# EAGLE design module (EAGLE 7.7.0)
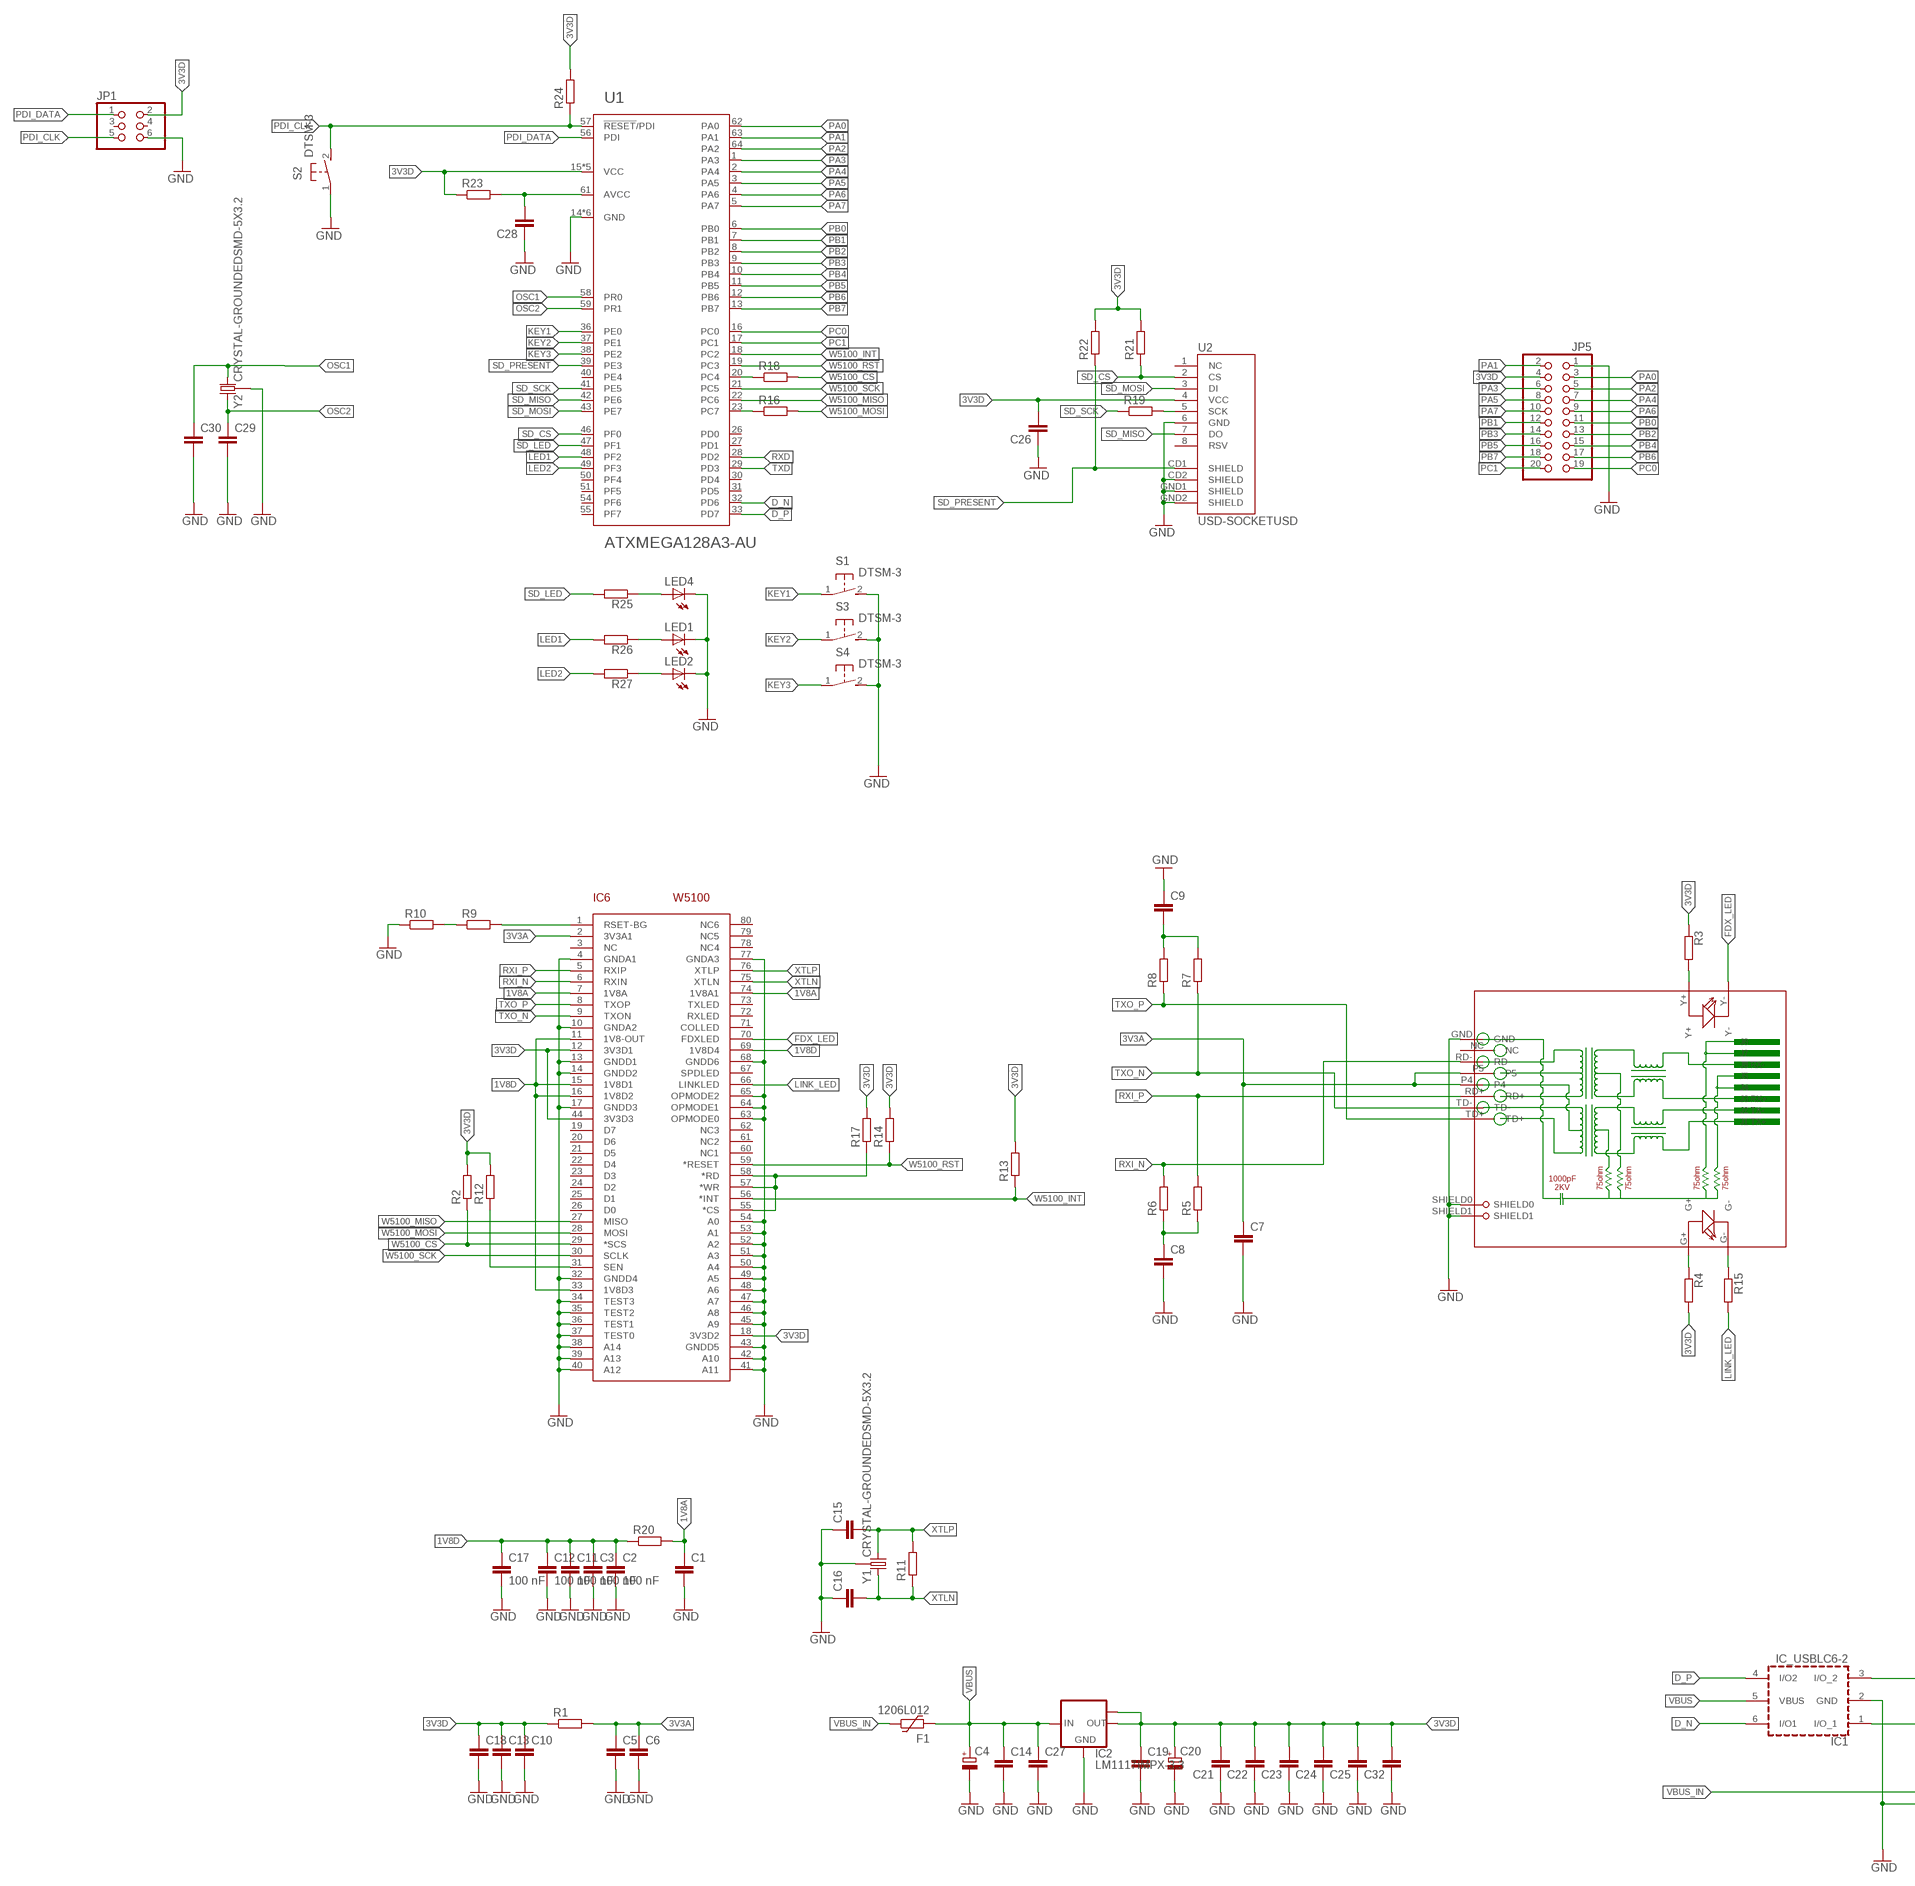
[diagram p0: schematic, sheet 1, part 1 of 2]
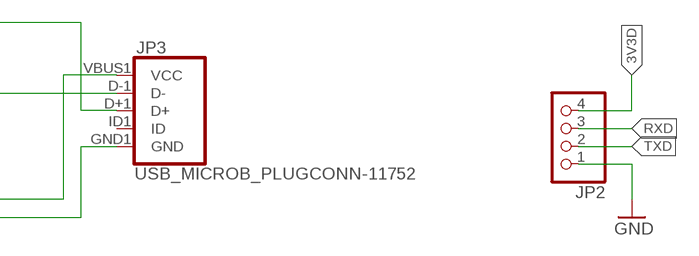
[diagram p1: schematic, sheet 1, part 2 of 2]

## Parts
C1  C-EUC0603  [C0603]
C2  100 nF  C-EUC0402  [C0402]
C3  100 nF  C-EUC0603  [C0603]
C4  CPOL-EUSMCB  [SMC_B]
C5  C-EUC0603  [C0603]
C6  C-EUC0603  [C0603]
C7  C-EUC0603  [C0603]
C8  C-EUC0603  [C0603]
C9  C-EUC0603  [C0603]
C10  C-EUC0402  [C0402]
C11  100 nF  C-EUC0402  [C0402]
C12  100 nF  C-EUC0402  [C0402]
C13  C-EUC0402  [C0402]
C14  C-EUC0603  [C0603]
C15  C-EUC0603  [C0603]
C16  C-EUC0603  [C0603]
C17  100 nF  C-EUC0402  [C0402]
C18  C-EUC0402  [C0402]
C19  C-EUC0603  [C0603]
C20  CPOL-EUSMCB  [SMC_B]
C21  C-EUC0402  [C0402]
C22  C-EUC0402  [C0402]
C23  C-EUC0402  [C0402]
C24  C-EUC0402  [C0402]
C25  C-EUC0402  [C0402]
C26  C-EUC0603  [C0603]
C27  C-EUC0603  [C0603]
C28  C-EUC0402  [C0402]
C29  C-EUC0603  [C0603]
C30  C-EUC0603  [C0603]
C32  C-EUC0603  [C0603]
F1  1206L012  [1206L]
IC1  IC_USBLC6-2  [SOT-23-6L]
IC2  LM1117IMPX-3.3  [SOT223]
IC6  W5100  [SQFP-S-10X10-80]
JP1  PINHD-2X3  [2X03]
JP2  PINHD-1X4  [1X04]
JP3  USB_MICROB_PLUGCONN-11752  [USB-B-MICRO-SMD_V03]
JP5  PINHD-2X10_2.54-SMD  [2X10SMD]
LED1  LEDCHIPLED_0805  [CHIPLED_0805]
LED2  LEDCHIPLED_0805  [CHIPLED_0805]
LED4  LEDCHIPLED_0805  [CHIPLED_0805]
R1  R-EU_R0805  [R0805]
R2  R-EU_R0603  [R0603]
R3  R-EU_R0603  [R0603]
R4  R-EU_R0603  [R0603]
R5  R-EU_R0603  [R0603]
R6  R-EU_R0603  [R0603]
R7  R-EU_R0603  [R0603]
R8  R-EU_R0603  [R0603]
R9  R-EU_R0603  [R0603]
R10  R-EU_R0603  [R0603]
R11  R-EU_R0603  [R0603]
R12  R-EU_R0402  [R0402]
R13  R-EU_R0603  [R0603]
R14  R-EU_R0402  [R0402]
R15  R-EU_R0603  [R0603]
R16  R-EU_R0603  [R0603]
R17  R-EU_R0603  [R0603]
R18  R-EU_R0603  [R0603]
R19  R-EU_R0603  [R0603]
R20  R-EU_R0805  [R0805]
R21  R-EU_R0603  [R0603]
R22  R-EU_R0603  [R0603]
R23  R-EU_R0805  [R0805]
R24  R-EU_R0603  [R0603]
R25  R-EU_R0603  [R0603]
R26  R-EU_R0603  [R0603]
R27  R-EU_R0603  [R0603]
RJ1  HR911105A  [HR911105A]
S1  DTSM-3  [DTSM-3]
S2  DTSM-3  [DTSM-3]
S3  DTSM-3  [DTSM-3]
S4  DTSM-3  [DTSM-3]
U1  ATXMEGA128A3-AU  [TQFP-64A-64]
U2  USD-SOCKETUSD  [USD-SOCKET-PP]
Y1  CRYSTAL-GROUNDEDSMD-5X3.2  [CRYSTAL-SMD-5X3.2-4PAD]
Y2  CRYSTAL-GROUNDEDSMD-5X3.2  [CRYSTAL-SMD-5X3.2-4PAD]

## Nets
1V8A: C1.1 IC6.7(1V8A) IC6.74(1V8A1) R20.2
1V8D: C2.1 C3.1 C11.1 C12.1 C17.1 IC6.11(1V8-OUT) IC6.15(1V8D1) IC6.16(1V8D2) IC6.33(1V8D3) IC6.69(1V8D4) R20.1
3V3A: C5.1 C6.1 C7.1 IC6.2(3V3A1) R1.2 RJ1.P4 RJ1.P5
3V3D: C10.1 C13.1 C18.1 C19.1 C20.+ C21.2 C22.2 C23.2 C24.2 C25.2 C26.2 C32.2 IC2.2(OUT) IC2.TAB(OUT1) IC6.12(3V3D1) IC6.18(3V3D2) IC6.44(3V3D3) JP1.2 JP2.4 JP5.4 R1.1 R2.2 R3.1 R4.2 R12.2 R13.2 R14.2 R17.2 R21.2 R22.2 R23.1 R24.2 U1.15(VCC) U1.25(VCC) U1.35(VCC) U1.45(VCC) U1.53(VCC) U2.4(VCC)
_W5100_CS: R18.1 U1.20(PC4)
AVCC: C28.2 R23.2 U1.61(AVCC)
D_N: IC1.6(I/O1) U1.32(PD6)
D_P: IC1.4(I/O2) U1.33(PD7)
DN: IC1.3(I/O_2) JP3.D+1(D+)
DP: IC1.1(I/O_1) JP3.D-1(D-)
FDX_LED: IC6.70(FDXLED) RJ1.Y-
GND: C1.2 C2.2 C3.2 C4.- C5.2 C6.2 C7.2 C8.2 C9.1 C10.2 C11.2 C12.2 C13.2 C14.2 C15.1 C16.1 C17.2 C18.2 C19.2 C20.- C21.1 C22.1 C23.1 C24.1 C25.1 C26.1 C27.2 C28.1 C29.2 C30.2 C32.1 IC1.2(GND) IC2.1(GND) IC6.4(GNDA1) IC6.10(GNDA2) IC6.13(GNDD1) IC6.14(GNDD2) IC6.17(GNDD3) IC6.32(GNDD4) IC6.34(TEST3) IC6.35(TEST2) IC6.36(TEST1) IC6.37(TEST0) IC6.38(A14) IC6.39(A13) IC6.40(A12) IC6.41(A11) IC6.42(A10) IC6.43(GNDD5) IC6.45(A9) IC6.46(A8) IC6.47(A7) IC6.48(A6) IC6.49(A5) IC6.50(A4) IC6.51(A3) IC6.52(A2) IC6.53(A1) IC6.54(A0) IC6.63(OPMODE0) IC6.64(OPMODE1) IC6.65(OPMODE2) IC6.68(GNDD6) IC6.77(GNDA3) JP1.6 JP2.1 JP3.GND1(GND) JP5.1 LED1.C LED2.C LED4.C R10.1 RJ1.GND RJ1.SHIELD0 RJ1.SHIELD1 S1.2 S2.1 S3.2 S4.2 U1.14(GND) U1.24(GND) U1.34(GND) U1.44(GND) U1.52(GND) U1.60(GND) U2.6(GND) U2.CD2(SHIELD) U2.GND1(SHIELD) U2.GND2(SHIELD) Y1.2 Y1.4 Y2.2 Y2.4
KEY1: S1.1 U1.36(PE0)
KEY2: S3.1 U1.37(PE1)
KEY3: S4.1 U1.38(PE2)
LED1: R26.2 U1.48(PF2)
LED2: R27.2 U1.49(PF3)
LINK_LED: IC6.66(LINKLED) R15.2
N$1: R4.1 RJ1.G+
N$2: R3.2 RJ1.Y+
N$3: C9.2 R7.2 R8.2
N$4: C8.1 R5.1 R6.1
N$5: R15.1 RJ1.G-
N$6: IC6.1(RSET-BG) R9.2
N$7: R9.1 R10.2
N$10: IC6.31(SEN) R12.1
N$11: R16.1 U1.23(PC7)
N$13: R19.2 U2.5(SCK)
N$14: LED4.A R25.1
N$15: LED1.A R26.1
N$16: LED2.A R27.1
N$26: IC6.55(*CS) IC6.57(*WR) IC6.58(*RD) R17.1
OSC1: C30.1 U1.58(PR0) Y2.1
OSC2: C29.1 U1.59(PR1) Y2.3
PA0: JP5.3 U1.62(PA0)
PA1: JP5.2 U1.63(PA1)
PA2: JP5.5 U1.64(PA2)
PA3: JP5.6 U1.1(PA3)
PA4: JP5.7 U1.2(PA4)
PA5: JP5.8 U1.3(PA5)
PA6: JP5.9 U1.4(PA6)
PA7: JP5.10 U1.5(PA7)
PB0: JP5.11 U1.6(PB0)
PB1: JP5.12 U1.7(PB1)
PB2: JP5.13 U1.8(PB2)
PB3: JP5.14 U1.9(PB3)
PB4: JP5.15 U1.10(PB4)
PB5: JP5.16 U1.11(PB5)
PB6: JP5.17 U1.12(PB6)
PB7: JP5.18 U1.13(PB7)
PC0: JP5.19 U1.16(PC0)
PC1: JP5.20 U1.17(PC1)
PDI_CLK: JP1.5 R24.1 S2.2 U1.57(!RESET!/PDI)
PDI_DATA: JP1.1 U1.56(PDI)
RXD: JP2.3 U1.28(PD2)
RXI_N: IC6.6(RXIN) R6.2 RJ1.RD-
RXI_P: IC6.5(RXIP) R5.2 RJ1.RD+
SD_CS: R21.1 U1.46(PF0) U2.2(CS)
SD_LED: R25.2 U1.47(PF1)
SD_MISO: U1.42(PE6) U2.7(DO)
SD_MOSI: U1.43(PE7) U2.3(DI)
SD_PRESENT: R22.1 U1.39(PE3) U2.CD1(SHIELD)
SD_SCK: R19.1 U1.41(PE5)
TXD: JP2.2 U1.29(PD3)
TXO_N: IC6.9(TXON) R7.1 RJ1.TD-
TXO_P: IC6.8(TXOP) R8.1 RJ1.TD+
VBUS: C4.+ C14.1 C27.1 F1.2 IC1.5(VBUS) IC2.3(IN)
VBUS_IN: F1.1 JP3.VBUS1(VCC)
W5100_CS: IC6.29(*SCS) R2.1 R18.2
W5100_INT: IC6.56(*INT) R13.1 U1.18(PC2)
W5100_MISO: IC6.27(MISO) U1.22(PC6)
W5100_MOSI: IC6.28(MOSI) R16.2
W5100_RST: IC6.59(*RESET) R14.1 U1.19(PC3)
W5100_SCK: IC6.30(SCLK) U1.21(PC5)
XTLN: C16.2 IC6.75(XTLN) R11.1 Y1.3
XTLP: C15.2 IC6.76(XTLP) R11.2 Y1.1
Unconnected: IC6.3(NC) IC6.19(D7) IC6.20(D6) IC6.21(D5) IC6.22(D4) IC6.23(D3) IC6.24(D2) IC6.25(D1) IC6.26(D0) IC6.60(NC1) IC6.61(NC2) IC6.62(NC3) IC6.67(SPDLED) IC6.71(COLLED) IC6.72(RXLED) IC6.73(TXLED) IC6.78(NC4) IC6.79(NC5) IC6.80(NC6) JP1.3 JP1.4 JP3.ID1(ID) RJ1.NC U1.26(PD0) U1.27(PD1) U1.30(PD4) U1.31(PD5) U1.40(PE4) U1.50(PF4) U1.51(PF5) U1.54(PF6) U1.55(PF7) U2.1(NC) U2.8(RSV)

## Library data of the parts
C1-C3 C5-C19 C21-C30 C32 = rcl:C-EU: CAPACITOR, European symbol
C4 C20 = rcl:CPOL-EU: POLARIZED CAPACITOR, European symbol
F1 = polyfuse-smd_10:?: Polyfuse Resettable PTC Source: http://www.littelfuse.com/products/resettable-ptcs.aspx; MF: Littelfuse; MPN: 1206L012; OC_FARNELL: 1596988; OC_NEWARK: 05M2298
IC1 = dp_devices:IC_USBLC6-2
IC2 = lm1117:LM1117IMPX-*
IC6 = SmartPrj:W5100
JP1 = pinhead:PINHD-2X3: PIN HEADER
JP2 = pinhead:PINHD-1X4: PIN HEADER
JP3 = SparkFun-Connectors:USB_MICROB_PLUG: USB Micro-B connectors Some male, some female. Watch your step!; PROD_ID: CONN-11752
JP5 = pinhead-2:PINHD-2X10: PIN HEADER
LED1 LED2 LED4 = led:LED: LED OSRAM: - CHIPLED LG R971, LG N971, LY N971, LG Q971, LY Q971, LO R971, LY R971 LH N974, LH R974 LS Q976, LO Q976, LY Q976 LO Q996 - Hyper CHIPLED LW Q18S LB Q993, LB Q99A, LB R99A - SideLED LS A670, LO A670, LY A670, LG A670, LP A670 LB A673, LV A673, LT A673, LW A673 LH A674 LY A675 LS A676, LA A676, LO A676, LY A676, LW A676 LS A679, LY A679, LG A679 - Hyper Micro SIDELED® LS Y876, LA Y876, LO Y876, LY Y876 LT Y87S - SmartLED LW L88C, LW L88S LB L89C, LB L89S, LG L890 LS L89K, LO L89K, LY L89K LS L896, LA L896, LO L896, LY L896 - TOPLED LS T670, LO T670, LY T670, LG T670, LP T670 LSG T670, LSP T670, LSY T670, LOP T670, LYG T670 LG T671, LOG T671, LSG T671 LB T673, LV T673, LT T673, LW T673 LH T674 LS T676, LA T676, LO T676, LY T676, LB T676, LH T676, LSB T676, LW T676 LB T67C, LV T67C, LT T67C, LS T67K, LO T67K, LY T67K, LW E67C LS E67B, LA E67B, LO E67B, LY E67B, LB E67C, LV E67C, LT E67C LW T67C LS T679, LY T679, LG T679 LS T770, LO T770, LY T770, LG T770, LP T770 LB T773, LV T773, LT T773, LW T773 LH T774 LS E675, LA E675, LY E675, LS T675 LS T776, LA T776, LO T776, LY T776, LB T776 LHGB T686 LT T68C, LB T68C - Hyper Mini TOPLED® LB M676 - Mini TOPLED Santana® LG M470 LS M47K, LO M47K, LY M47K Source: http://www.osram.convergy.de LUXEON: - LUMILED® LXK2-PW12-R00, LXK2-PW12-S00, LXK2-PW14-U00, LXK2-PW14-V00 LXK2-PM12-R00, LXK2-PM12-S00, LXK2-PM14-U00 LXK2-PE12-Q00, LXK2-PE12-R00, LXK2-PE12-S00, LXK2-PE14-T00, LXK2-PE14-U00 LXK2-PB12-K00, LXK2-PB12-L00, LXK2-PB12-M00, LXK2-PB14-N00, LXK2-PB14-P00, LXK2-PB14-Q00 LXK2-PR12-L00, LXK2-PR12-M00, LXK2-PR14-Q00, LXK2-PR14-R00 LXK2-PD12-Q00, LXK2-PD12-R00, LXK2-PD12-S00 LXK2-PH12-R00, LXK2-PH12-S00 LXK2-PL12-P00, LXK2-PL12-Q00, LXK2-PL12-R00 Source: www.luxeon.com KINGBRIGHT: KA-3528ASYC Source: www.kingbright.com
R1-R27 = rcl:R-EU_: RESISTOR, European symbol
RJ1 = hanrun:HR911105A
S1-S4 = switch-tact:DTSM-3
U1 = atmel-xmega:ATXMEGA128A3: 8/16-bit XMEGA A3 Microcontroller Features High-performance, Low-power 8/16-bit Atmel® AVR® XMEGATM Microcontroller Non-volatile Program and Data Memories – 64 KB - 256 KB of In-System Self-Programmable Flash – 4 KB - 8 KB Boot Code Section with Independent Lock Bits – 2 KB - 4 KB EEPROM – 4 KB - 16 KB Internal SRAM Peripheral Features – Four-channel DMA Controller with support for external requests – Eight-channel Event System – Seven 16-bit Timer/Counters Four Timer/Counters with 4 Output Compare or Input Capture channels Three Timer/Counters with 2 Output Compare or Input Capture channels High Resolution Extensions on all Timer/Counters Advanced Waveform Extension on one Timer/Counter – Seven USARTs IrDA Extension on 1 USART – AES and DES Crypto Engine – Two Two-wire Interfaces with dual address match (I2C and SMBus compatible) – Three SPI (Serial Peripheral Interfaces) – 16-bit Real Time Counter with Separate Oscillator – Two Eight-channel, 12-bit, 2 Msps Analog to Digital Converters – One Two-channel, 12-bit, 1 Msps Digital to Analog Converter – Four Analog Comparators with Window compare function – External Interrupts on all General Purpose I/O pins – Programmable Watchdog Timer with Separate On-chip Ultra Low Power Oscillator Special Microcontroller Features – Power-on Reset and Programmable Brown-out Detection – Internal and External Clock Options with PLL – Programmable Multi-level Interrupt Controller – Sleep Modes: Idle, Power-down, Standby, Power-save, Extended Standby – Advanced Programming, Test and Debugging Interfaces JTAG (IEEE 1149.1 Compliant) Interface for test, debug and programming PDI (Program and Debug Interface) for programming, test and debugging I/O and Packages – 50 Programmable I/O Lines – 64-lead TQFP – 64-pad QFN Operating Voltage – 1.6 – 3.6V Speed performance – 0 – 12 MHz @ 1.6 – 3.6V – 0 – 32 MHz @ 2.7 – 3.6V
U2 = SparkFun-Connectors:USD-SOCKET: microSD Socket Push-push type uSD socket. Schematic element and footprint production proven. Spark Fun Electronics SKU : PRT-00127. tDoc lines correctly indicate media card edge positions when inserting (unlocked, locked, depressed).
Y1 Y2 = SparkFun-Clocks:CRYSTAL-GROUNDED: Crystals w/ Ground Pin (Generic) These are passive quartz crystals, which can be used as a clock source for a microcontroller. Crystal's are usually two-terminal devices. A third terminal may be optionally connected to ground, as recommended by the manufaturer.

## Board
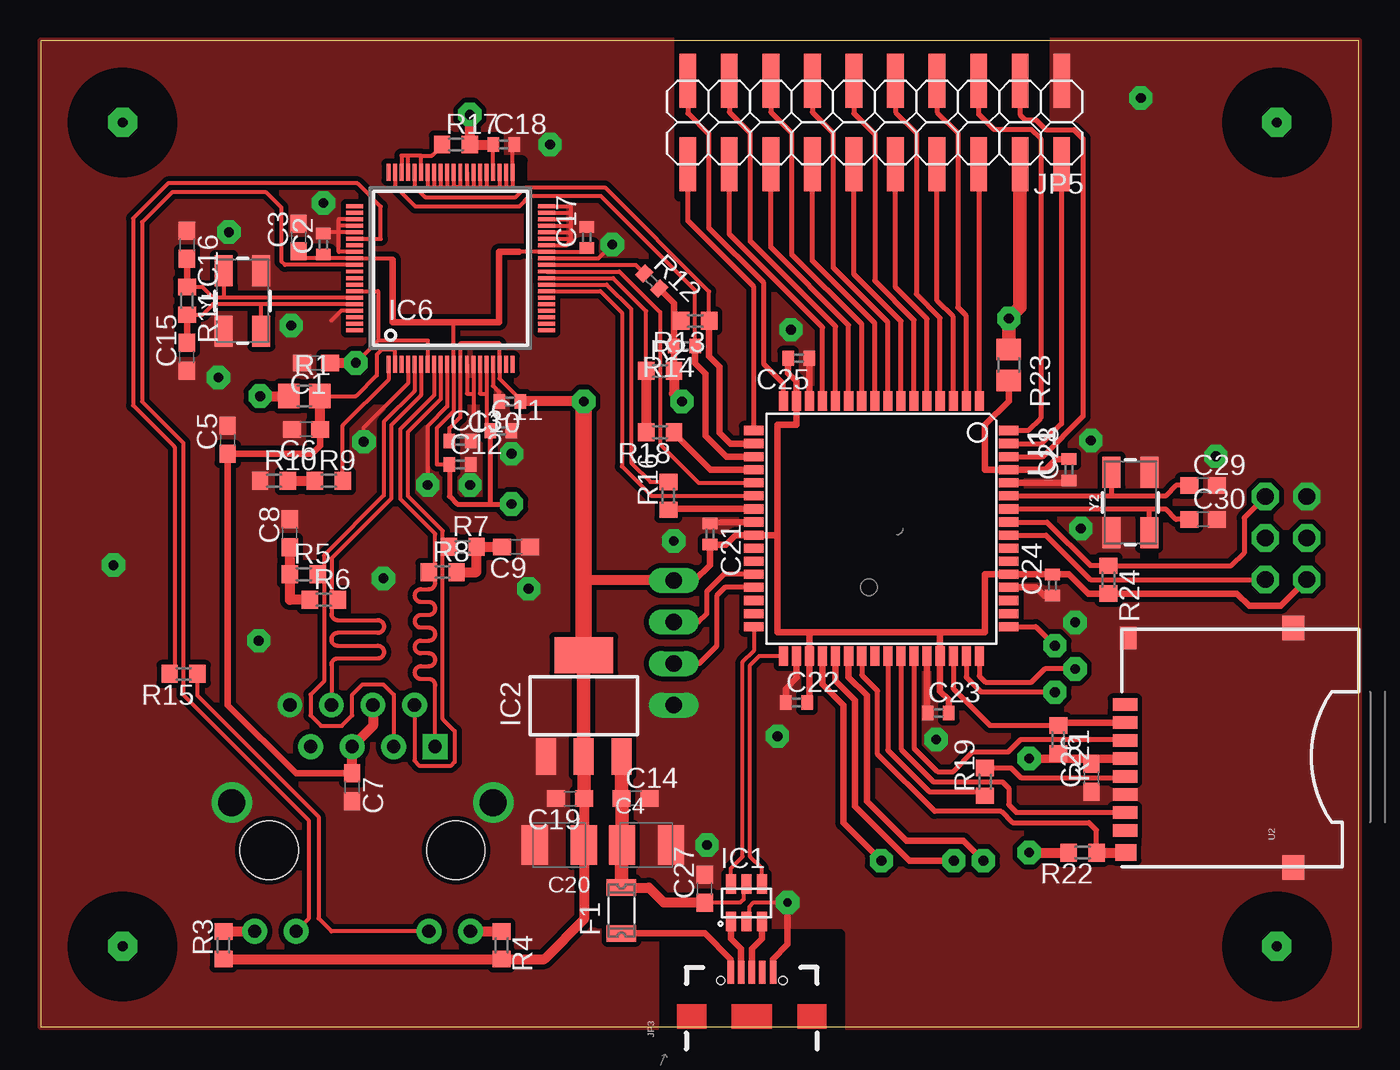
[diagram p2: board, top side]
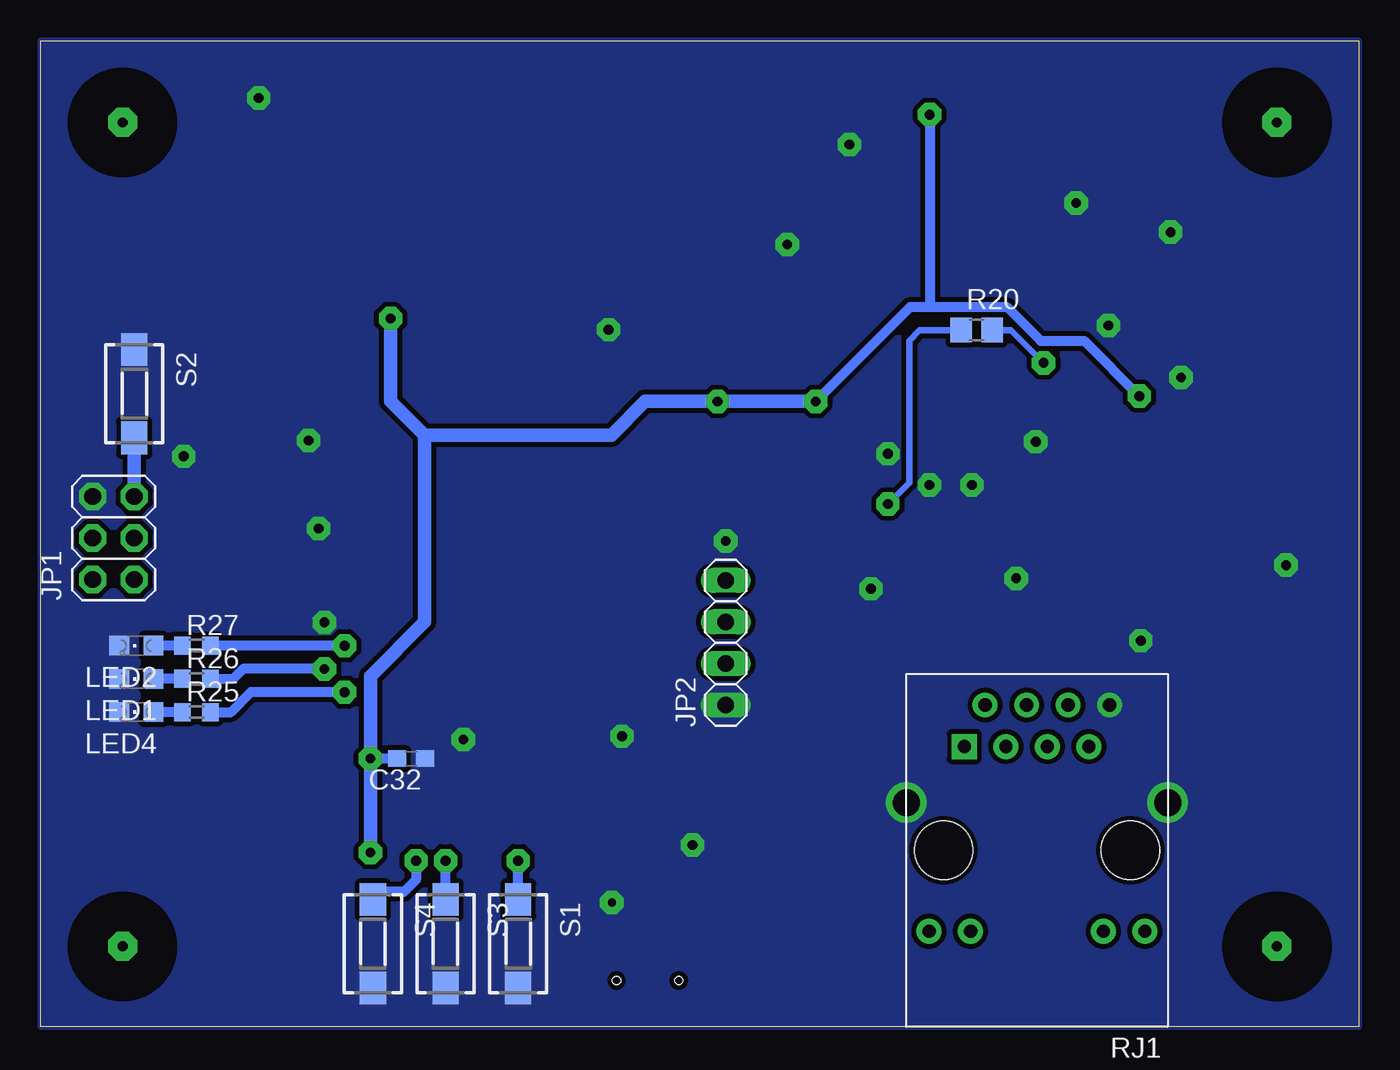
[diagram p3: board, bottom side, seen from below]

Size 80.64 x 60.31 mm. Coordinates in mm from the lower left corner, seen from the top.
Outline: 0,0 80.64,0 80.64,60.31 0,60.31 0,0
Copper layers (1*16): Top 0.035mm / dielectric 1.5mm / Bottom 0.035mm
Design rules "default *": minimum track width 10mil, minimum drill 24mil, track to track 8mil, track to pad 8mil, pad to pad 8mil, via to via 8mil, smd to smd 8mil, copper to edge 0mil, drill to drill 8mil, minimum pad ring 10mil, minimum via ring 8mil, stop-mask expansion 4mil, vias tented up to drill 0mil, thermal gap 10mil
tRestrict: area 20.3,38.4 to 27.3,39.4; area 23.5,51.4 to 29.5,53; area 29.8,47.6 to 31.9,51.4; area 34.1,6.4 to 34.7,17.7; area 34.9,6.2 to 36.4,7.9; area 41.9,5.7 to 44.5,8.1; area 38.1,0 to 48.9,5.7; area 43,24.2 to 44.2,36.8; area 45.2,22.1 to 57.7,23.3; area 58.6,24.2 to 59.8,36.8; area 45.1,37.7 to 57.7,38.9; area 2,52.3 to 8,58.4; 4 more areas
bRestrict: area 2,52.3 to 8,58.4; area 72.6,52.3 to 78.7,58.4; area 72.6,1.9 to 78.7,8; area 2,1.9 to 8,8

### Footprints (pad centres in the part's own frame; a part is rotated, then mirrored left to right if it is on the bottom)
C0603 = smd 1.1 x 1: 1 -0.85,0; 2 0.85,0
C0402 = smd 0.7 x 0.9: 1 -0.65,0; 2 0.65,0
SMC_B = smd 1.6 x 2.4: + -1.5,0; - 1.5,0
1206L = smd 1 x 1.8: 1 -1.4,0; 2 1.4,0
SOT-23-6L = smd 0.6 x 1.2: 1 -0.95,-2.3; 2 0,-2.3; 3 0.95,-2.3; 4 0.95,0; 5 0,0; 6 -0.95,0
SOT223 = smd 1.219 x 2.235: 1 -2.311,-3.099; 2 0,-3.099; 3 2.311,-3.099 | smd 3.6 x 2.2: TAB 0,3.099
SQFP-S-10X10-80 = smd 0.241 x 1.041: 1 -3.8,-5.879; 2 -3.4,-5.879; 3 -3,-5.879; 4 -2.6,-5.879; 5 -2.2,-5.879; 6 -1.8,-5.879; 7 -1.4,-5.879; 8 -1,-5.879; 9 -0.6,-5.879; 10 -0.2,-5.879; 11 0.2,-5.879; 12 0.6,-5.879; 13 1,-5.879; 14 1.4,-5.879; 15 1.8,-5.879; 16 2.2,-5.879; 17 2.6,-5.879; 18 3,-5.879; 19 3.4,-5.879; 20 3.8,-5.879; 41 3.8,5.879; 42 3.4,5.879; 43 3,5.879; 44 2.6,5.879; 45 2.2,5.879; 46 1.8,5.879; 47 1.4,5.879; 48 1,5.879; 49 0.6,5.879; 50 0.2,5.879; 51 -0.2,5.879; 52 -0.6,5.879; 53 -1,5.879; 54 -1.4,5.879; 55 -1.8,5.879; 56 -2.2,5.879; 57 -2.6,5.879; 58 -3,5.879; 59 -3.4,5.879; 60 -3.8,5.879 | smd 1.041 x 0.241: 21 5.879,-3.8; 22 5.879,-3.4; 23 5.879,-3; 24 5.879,-2.6; 25 5.879,-2.2; 26 5.879,-1.8; 27 5.879,-1.4; 28 5.879,-1; 29 5.879,-0.6; 30 5.879,-0.2; 31 5.879,0.2; 32 5.879,0.6; 33 5.879,1; 34 5.879,1.4; 35 5.879,1.8; 36 5.879,2.2; 37 5.879,2.6; 38 5.879,3; 39 5.879,3.4; 40 5.879,3.8; 61 -5.879,3.8; 62 -5.879,3.4; 63 -5.879,3; 64 -5.879,2.6; 65 -5.879,2.2; 66 -5.879,1.8; 67 -5.879,1.4; 68 -5.879,1; 69 -5.879,0.6; 70 -5.879,0.2; 71 -5.879,-0.2; 72 -5.879,-0.6; 73 -5.879,-1; 74 -5.879,-1.4; 75 -5.879,-1.8; 76 -5.879,-2.2; 77 -5.879,-2.6; 78 -5.879,-3; 79 -5.879,-3.4; 80 -5.879,-3.8
2X03 = drill 1.016 pad 1.676 octagon: 1 -2.54,-1.27; 2 -2.54,1.27; 3 0,-1.27; 4 0,1.27; 5 2.54,-1.27; 6 2.54,1.27
1X04 = drill 1.016 long: 1 -3.81,0; 2 -1.27,0; 3 1.27,0; 4 3.81,0
USB-B-MICRO-SMD_V03 = smd 1.4 x 0.4: D+1 2.7,0; D-1 2.7,0.65; GND1 2.7,-1.3; ID1 2.7,-0.65; VBUS1 2.7,1.3 | hole 0.5: 2.2,1.9; 2.2,-1.9
2X10SMD = smd 1.016 x 3.302: 1 -1.27,-3.81; 2 -1.27,1.27; 3 1.27,-3.81; 4 1.27,1.27; 5 3.81,-3.81; 6 3.81,1.27; 7 6.35,-3.81; 8 6.35,1.27; 9 8.89,-3.81; 10 8.89,1.27; 11 11.43,-3.81; 12 11.43,1.27; 13 13.97,-3.81; 14 13.97,1.27; 15 16.51,-3.81; 16 16.51,1.27; 17 19.05,-3.81; 18 19.05,1.27; 19 21.59,-3.81; 20 21.59,1.27
CHIPLED_0805 = smd 1.2 x 1.2: A 0,-1.05; C 0,1.05
R0805 = smd 1.3 x 1.5: 1 -0.95,0; 2 0.95,0
R0603 = smd 1 x 1.1: 1 -0.85,0; 2 0.85,0
R0402 = smd 0.7 x 0.9: 1 -0.65,0; 2 0.65,0
HR911105A = drill 0.813 pad 1.524: G+ 4.953,-6.604; G- 4.953,-4.064; GND -8.89,4.445; NC -6.35,3.175; P4 -8.89,-0.635; P5 -6.35,0.635; RD+ -6.35,-1.905; RD- -8.89,1.905; TD- -8.89,-3.175; Y+ 4.953,6.604; Y- 4.953,4.064 | drill 1.651 pad 2.159: SHIELD0 -2.921,8.001; SHIELD1 -2.921,-8.001 | drill 0.813 pad 1.524 square: TD+ -6.35,-4.445 | hole 3.556: 0,-5.715; 0,5.715
DTSM-3 = smd 2 x 1.6: 1 -2.7,0; 2 2.7,0
TQFP-64A-64 = smd 1.194 x 0.559: 1 -7.8,6; 2 -7.8,5.2; 3 -7.8,4.4; 4 -7.8,3.6; 5 -7.8,2.8; 6 -7.8,2; 7 -7.8,1.2; 8 -7.8,0.4; 9 -7.8,-0.4; 10 -7.8,-1.2; 11 -7.8,-2; 12 -7.8,-2.8; 13 -7.8,-3.6; 14 -7.8,-4.4; 15 -7.8,-5.2; 16 -7.8,-6; 33 7.8,-6; 34 7.8,-5.2; 35 7.8,-4.4; 36 7.8,-3.6; 37 7.8,-2.8; 38 7.8,-2; 39 7.8,-1.2; 40 7.8,-0.4; 41 7.8,0.4; 42 7.8,1.2; 43 7.8,2; 44 7.8,2.8; 45 7.8,3.6; 46 7.8,4.4; 47 7.8,5.2; 48 7.8,6 | smd 0.559 x 1.194: 17 -6,-7.8; 18 -5.2,-7.8; 19 -4.4,-7.8; 20 -3.6,-7.8; 21 -2.8,-7.8; 22 -2,-7.8; 23 -1.2,-7.8; 24 -0.4,-7.8; 25 0.4,-7.8; 26 1.2,-7.8; 27 2,-7.8; 28 2.8,-7.8; 29 3.6,-7.8; 30 4.4,-7.8; 31 5.2,-7.8; 32 6,-7.8; 49 6,7.8; 50 5.2,7.8; 51 4.4,7.8; 52 3.6,7.8; 53 2.8,7.8; 54 2,7.8; 55 1.2,7.8; 56 0.4,7.8; 57 -0.4,7.8; 58 -1.2,7.8; 59 -2,7.8; 60 -2.8,7.8; 61 -3.6,7.8; 62 -4.4,7.8; 63 -5.2,7.8; 64 -6,7.8
USD-SOCKET-PP = smd 0.75 x 1.5: 1 3.2,14.3; 2 2.1,14.3; 3 1,14.3; 4 -0.1,14.3; 5 -1.2,14.3; 6 -2.3,14.3; 7 -3.4,14.3; 8 -4.5,14.3 | smd 1 x 1.3: CD1 -5.85,14.25 | smd 1.4 x 1: CD2 7.275,14.1 | smd 1.5 x 1.35: GND1 -6.775,4; GND2 7.875,4
CRYSTAL-SMD-5X3.2-4PAD = smd 1.9 x 1.1: 1 -1.85,-1.15; 2 1.85,-1.15; 3 1.85,1.15; 4 -1.85,1.15

### Placement (x,y rotation side)
C1  16.85,40.61 180 top
C2  17.29,47.89 90 top
C3  15.77,48.29 90 top
C4  37.06,11.13 0 top
C5  11.43,35.91 90 top
C6  16.23,36.55 180 top
C7  19.05,14.66 270 top
C8  15.24,30.2 90 top
C9  29.08,29.36 180 top
C10  28.7,38.25 180 top
C11  28.15,36.46 0 top
C12  25.66,34.39 0 top
C13  25.66,35.83 0 top
C14  36.4,13.97 0 top
C15  8.94,40.98 90 top
C16  8.94,47.84 270 top
C17  33.41,48.29 90 top
C18  28.33,53.98 0 top
C19  32.38,13.97 180 top
C20  31.72,11.13 180 top
C21  40.94,30.15 270 top
C22  46.24,19.84 0 top
C23  54.91,19.2 0 top
C24  61.9,27.03 90 top
C25  46.38,40.89 180 top
C26  64.29,15.24 90 top
C27  40.62,8.45 90 top
C28  62.92,34.08 90 top
C29  71.12,33.12 0 top
C30  71.12,31.05 0 top
C32  57.99,16.41 180 bottom
F1  35.53,7.11 90 top
IC1  43.18,8.75 0 top
IC2  33.22,19.63 0 top
IC6  25.07,46.41 0 top
JP1  76.2,29.9 90 bottom
JP2  38.73,23.5 90 bottom
JP3  43.51,0.64 90 top
JP5  61.19,54.05 180 top
LED1  74.8,21.29 90 bottom
LED2  74.8,23.32 90 bottom
LED4  74.8,19.25 90 bottom
R1  16.13,38.58 0 top
R2  37.9,40.13 0 top
R3  11.18,4.99 90 top
R4  28.19,4.99 270 top
R5  16.1,27.69 0 top
R6  17.32,26.12 0 top
R7  25.81,29.36 0 top
R8  24.59,27.81 0 top
R9  17.63,33.4 0 top
R10  14.27,33.4 0 top
R11  8.94,44.41 270 top
R12  37.38,45.63 315 top
R13  40.05,43.18 180 top
R14  39.4,41.65 180 top
R15  8.74,21.59 180 top
R16  38.4,32.48 90 top
R17  25.4,53.98 0 top
R18  37.9,36.37 180 top
R19  57.78,14.99 90 top
R20  23.38,42.62 0 bottom
R21  62.26,17.58 270 top
R22  63.75,10.66 180 top
R23  59.23,40.49 270 top
R24  65.33,27.36 270 top
R25  71.12,19.25 0 bottom
R26  71.12,21.29 0 bottom
R27  71.12,23.32 0 bottom
RJ1  19.68,10.79 270 bottom
S1  51.44,5.08 270 bottom
S2  74.93,38.73 270 bottom
S3  55.88,5.08 270 bottom
S4  60.33,5.08 270 bottom
U1  51.44,30.48 270 top
U2  80.64,16.51 90 top
Y1  12.34,44.41 90 top
Y2  66.67,32.08 90 top

### Tracks (layer width: path | path; a pad name or v marks a point on that pad's centre or on a via)
1V8A  (via drill 0.6 pad 1.42)
  Top 0.241: 20.62,41.99 23.67,41.99 IC6.7 | IC6.74 20.62,45.01 20.62,41.99 | v19.28,40.62 20.62,41.96 20.62,41.99
  Top 0.61: C1.1 v19.28,40.62
  Bottom 0.406: R20.2 21.29,42.62 v19.28,40.62
1V8D  (via drill 0.6 pad 1.42)
  Top 0.241: 25.27,42.99 IC6.11 25.27,37.66 24.23,36.63 24.23,34.39 C12.1 | 29.27,47.41 IC6.33 33.18,47.41 C17.1 | IC6.69 17.14,47.01 | 17.14,47.01 16.2,47.01 C3.1 | IC6.16 27.27,38.73 | 27.27,38.73 27.27,36.69 C11.1 | IC6.15 26.87,38.73 27.27,38.73 | C2.1 17.29,47.15 17.14,47.01 | 27.5,32.06 27.58,31.98
  Top 0.254: IC6.69 21.51,47.01 21.51,46.91 | 25.27,42.99 25.4,43.12
  Top 0.305: C11.1 27.5,32.06 | v28.8,31.98 27.58,31.98 25.48,31.98 25.01,32.44 C12.1
  Top 0.406: 21.51,46.91 21.51,43.12 25.4,43.12 28.03,43.12 28.03,47.41 29.27,47.41
  Bottom 0.406: v28.8,31.98 27.5,33.28 27.5,41.98 26.86,42.62 R20.1
3V3A
  Top 0.241: 20.85,41.42 20.55,41.12 20.55,39.85 19.28,38.58 R1.2
  Top 0.254: IC6.2 21.67,41.42 20.85,41.42
  Top 0.406: C6.1 17.08,35.55 16.59,35.05 C5.1 11.43,19.68 15.61,15.51 C7.1
  Top 0.61: RJ1.P4 20.32,18.41 RJ1.P5 C7.1 | C6.1 R1.2
3V3D  (via drill 0.6 pad 1.42)
  Top 0.241: IC6.12 25.67,37.29 25.01,36.63 C13.1 | IC6.18 28.07,39.65 29.35,38.36 | IC6.44 27.67,53.97 C18.1 | 29.35,38.36 C10.1 | 29.46,38.25 29.35,38.36 | R13.2 38.75,43.18
  Top 0.254: IC6.18 28.07,41.81 25.68,41.81 25.68,40.53 IC6.12
  Top 0.305: C26.2 64.29,16.26 64.14,16.41 | R21.2 62.26,16.43 62.23,16.41
  Top 0.406: R14.2 | R12.2 38.75,44.26 38.75,43.18 R14.2 | R14.2 R2.2 | C23.2 55.56,20 55.03,20.53 U1.45 55.03,24.13 | C25.2 45.73,39.99 46.23,39.49 U1.15 46.23,36.83 45.09,36.83 45.09,30.08 | 45.09,30.08 U1.25 42.5,30.08 41.92,29.5 C21.2 40.95,28.25 40.01,27.3 JP2.4 | 45.09,30.08 45.09,24.13 47.03,24.13 | 47.03,24.13 U1.35 47.03,19.99 C22.2 | 47.03,24.13 55.03,24.13 | 55.03,24.13 57.78,24.13 57.78,27.68 U1.53 C24.2 62.93,27.68 64.1,26.51 R24.2 73.19,26.51 73.94,25.76 75.87,25.76 JP1.2 | C20.+ 33.23,11.42 33.23,11.43
  Top 0.508: U2.4 64.14,16.41 62.23,16.41 v60.48,16.41
  Top 0.61: R3.1 R4.2 30.81,4.14 33.23,6.57 33.23,11.43 C19.1 | v13.42,38.58 R1.1 | v33.22,38.25 29.46,38.25 | C18.1 R17.2 v26.25,55.8 | v60.48,10.66 R22.2 | JP2.4 33.22,27.3 | R2.2 38.74,38.74 v39.23,38.25
  Top 0.813: C19.1 33.23,16.52 IC2.2 IC2.TAB | R23.1 v59.23,43.33 59.92,44.02 JP5.4 | 33.22,27.31 33.22,27.3
  Top 1.016: 33.22,27.31 v33.22,38.25 | 33.22,27.3 IC2.TAB
  Bottom 0.406: 60.49,16.39 v60.48,16.41
  Bottom 0.61: 26.42,44.04 27.43,44.04 v33.22,38.25 | 26.42,44.04 21.54,44.04 19.46,41.96 16.8,41.96 v13.42,38.58 | v26.25,55.8 26.25,44.21 26.42,44.04 | v60.49,16.42 v60.48,16.41 C32.2
  Bottom 0.813: v33.22,38.25 v39.23,38.25 43.66,38.25 45.72,36.2 57.15,36.2 | v60.48,10.66 v60.48,16.41 60.48,21.44 57.15,24.77 57.15,36.2 | 57.15,36.2 59.23,38.28 v59.23,43.33
_W5100_CS
  Top 0.406: 38.75,36.46 R18.1 38.75,36.31 40.98,34.08 U1.20
AVCC
  Top 0.406: R23.2 59.23,38.28 57.78,36.83 57.78,34.08 U1.61 61.46,34.08 62.11,34.73 C28.2
D_N
  Top 0.254: IC1.6 42.23,9.69 42.95,10.41 42.95,22.32 43.63,23 U1.32
D_P
  Top 0.254: IC1.4 44.13,9.69 43.41,10.41 43.41,22.13 43.96,22.68 U1.33
DN
  Top 0.406: IC1.3 44.13,5.39 43.51,4.77 JP3.D+1
DP
  Top 0.406: IC1.1 42.23,5.39 42.86,4.77 JP3.D-1
FDX_LED
  Top 0.241: IC6.70 14.94,46.61 14.73,46.81 14.73,50.11 13.79,51.05 8.03,51.05 6.2,49.23 6.2,38.25 8.74,35.71 8.74,20.3 16.38,12.65 16.38,6.6 RJ1.Y-
GND  (via drill 0.5 pad 1.42, 0.6 pad 1.42)
  Top 0.241: IC6.65 18.24,48.61 | IC6.64 18.24,49.01 | IC6.32 34.12,47.01 v34.97,47.85 | IC6.77 18.38,43.81 17.78,43.2 | IC6.68 18.24,47.41 18.24,48.61 | IC6.63 18.24,49.41 18.24,49.01 | IC6.17 27.67,39.21 28.05,38.83 C10.2 | IC6.14 26.47,38.73 | 26.47,38.73 26.47,37.49 | IC6.13 26.07,38.73 26.47,38.73 | IC6.10 24.87,37.95 23.67,36.75 v23.67,33.15 | 18.24,48.61 18.24,49.01 | 18.24,48.61 17.36,48.61 C2.2 | IC6.4 22.47,39.36 19.76,36.65 v19.76,35.79 | IC6.54 23.67,51.36 24.07,51.36 | 24.07,51.36 24.47,51.36 | 24.87,51.36 25.27,51.36 | 25.67,51.36 26.07,51.36 | 26.07,51.36 26.47,51.36 | 26.87,51.36 27.27,51.36 | 27.27,51.36 28.07,51.36 | 28.07,51.36 28.47,51.36 | 28.47,51.36 28.87,51.36 IC6.41 28.87,53.87 C18.2 | IC6.53 24.07,51.36 | IC6.52 24.47,51.36 | 24.47,51.36 24.87,51.36 | IC6.51 24.87,51.36 | IC6.50 25.27,51.36 | IC6.49 25.67,51.36 | 25.67,51.36 25.27,51.36 | IC6.48 26.07,51.36 | IC6.47 26.47,51.36 | 26.47,51.36 26.87,51.36 | IC6.46 26.87,51.36 | IC6.45 27.27,51.36 | IC6.43 28.07,51.36 | IC6.42 28.47,51.36 | IC6.34 32.16,47.81 32.49,48.13 32.41,48.21 | IC6.35 32.41,48.21 | IC6.40 32.41,50.21 32.41,49.73 | 32.41,49.73 32.41,49.38 | 32.41,49.38 32.41,48.95 | 32.41,48.95 32.41,48.46 | 32.41,48.46 32.41,48.21 | IC6.36 32.27,48.61 32.41,48.46 | IC6.37 32.35,49.01 32.41,48.95 | IC6.38 32.39,49.41 32.41,49.38 | IC6.39 32.34,49.81 32.41,49.73
  Top 0.254: IC1.2 43.36,6.63 43.36,7.34 43.62,7.61 v45.7,7.61
  Top 0.406: JP3.GND1 44.81,4.15 45.7,5.04 v45.7,7.61 | U1.24 41.66,30.88 C21.1 | U1.44 54.23,19.23 C23.1 | U1.52 60.9,26.88 61.41,26.38 C24.1 | C25.1 47.03,40.71 U1.14 | U1.34 46.23,21.34 45.59,20.69 C22.1 | U1.60 62.77,33.28 C28.1
  other vias: 26.26,33.15 28.8,35.05 15.32,42.9 20.95,27.43 10.87,39.73 11.51,48.62 17.29,50.39 13.34,23.62 31.16,53.98 40.77,11.13 38.73,29.72 45.09,17.78 54.79,17.58 64.26,35.86 71.91,34.9 63.65,30.48 63.3,24.74 45.9,42.65 67.31,56.82 4.45,28.24 29.84,26.8
  pour Top (isolate 0.305, rank 2, no thermals): 0,60.33 0,0 80.64,0 80.64,60.33
  pour Bottom (isolate 0.305, no thermals): 0,60.33 0,0 80.64,0 80.64,60.33
KEY1  (via drill 0.6 pad 1.42)
  Top 0.406: U1.36 47.84,20.95 49.12,19.66 49.12,12.47 v51.44,10.16
  Bottom 0.61: S1.1 v51.44,10.16
KEY2  (via drill 0.6 pad 1.42)
  Top 0.406: U1.37 48.63,21.16 49.84,19.96 49.84,13.49 53.16,10.16 v55.88,10.16
  Bottom 0.61: S3.1 v55.88,10.16
KEY3  (via drill 0.6 pad 1.42)
  Top 0.406: U1.38 49.44,21.38 50.55,20.27 50.55,13.79 52.96,11.38 56.46,11.38 v57.68,10.16
  Bottom 0.61: v57.68,10.16 57.68,8.99 58.42,8.26 59.85,8.26 S4.1
LED1  (via drill 0.6 pad 1.42)
  Top 0.305: U1.48 57.44,21.46 57.81,21.08 60.63,21.08 61.44,21.89 v63.3,21.89
  Bottom 0.61: v63.3,21.89 68.28,21.89 68.89,21.29 R26.2
LED2  (via drill 0.6 pad 1.42)
  Top 0.305: U1.49 60.89,24.48 v62.05,23.32
  Bottom 0.61: v62.05,23.32 R27.2
LINK_LED
  Top 0.241: IC6.66 20.8,48.21 20.8,50.17 19.37,51.59 7.78,51.59 5.64,49.45 5.64,38.02 8.18,35.48 8.18,21.88 R15.2
N$1
  Top 0.61: RJ1.G+ R4.1
N$2
  Top 0.61: R3.2 RJ1.Y+
N$3
  Top 0.61: C9.2 R7.2 26.66,27.81 R8.2
N$4
  Top 0.61: R6.1 15.25,26.12 R5.1 C8.1
N$5
  Top 0.241: RJ1.G- 17.78,5.84 16.99,6.63 16.99,12.85 9.59,20.26 R15.1
N$6
  Top 0.241: R9.2 18.48,36.79 21.27,39.58 IC6.1
N$7
  Top 0.61: R10.2 R9.1
N$8
  cutout Top: 18.36,50.26 20.09,50.27 20.32,47.52 18.36,47.52
N$9
  cutout Top: 30.12,45.52 30.12,46.99 32.46,46.99 31.83,45.52
N$10
  Top 0.241: IC6.31 36.4,46.61 R12.1
N$11
  Top 0.254: 38.51,31.68 R16.1
  Top 0.406: U1.23 38.51,31.68
N$13
  Top 0.305: R19.2 59.37,15.84 59.97,15.24 66.28,15.24 U2.5
N$14
  Bottom 0.61: R25.1 LED4.A
N$15
  Bottom 0.61: R26.1 LED1.A
N$16
  Bottom 0.61: R27.1 LED2.A
N$26
  Top 0.241: IC6.55 23.27,53.29 | 24.55,53.94 R17.1 24.55,53.91 23.93,53.29 23.27,53.29 | 23.27,53.29 22.53,53.29 | 22.53,53.29 22.07,53.29 IC6.58 | IC6.57 22.47,53.23 22.53,53.29
OSC1
  Top 0.305: U1.58 67.82,31.68 | 67.82,31.68 68.83,31.68 69.47,31.05 C30.1 | Y2.1 67.83,31.67 67.82,31.68
OSC2
  Top 0.305: U1.59 65.56,32.48 | 65.56,32.48 68.83,32.48 69.47,33.12 C29.1 | Y2.3 65.53,32.51 65.56,32.48
PA0
  Top 0.305: U1.62 61.32,34.88 63.78,37.34 63.78,54.33 63.22,54.89 61.49,54.89 60.88,55.5 60.22,55.5 59.92,55.8 JP5.3
PA1
  Top 0.305: U1.63 61.26,35.68 62.46,36.88 JP5.2
PA2
  Top 0.305: U1.64 60.43,36.48 61.19,37.24 61.19,54.33 60.63,54.89 58.34,54.89 57.38,55.85 JP5.5
PA3
  Top 0.305: U1.1 57.44,52.73 JP5.6
PA4
  Top 0.305: U1.2 56.63,43.49 56.11,44.02 56.11,54.69 54.84,55.96 JP5.7
PA5
  Top 0.305: U1.3 55.84,43.43 54.84,44.42 JP5.8
PA6
  Top 0.305: U1.4 55.03,43.37 53.57,44.83 53.57,54.69 52.3,55.96 JP5.9
PA7
  Top 0.305: U1.5 54.23,43.3 52.3,45.24 JP5.10
PB0
  Top 0.305: U1.6 53.44,43.24 51.03,45.64 51.03,54.61 | 51.03,54.69 51.03,54.61 | JP5.11 49.76,55.88 51.03,54.61
PB1
  Top 0.305: U1.7 52.63,43.17 49.76,46.05 JP5.12
PB2
  Top 0.305: U1.8 51.84,43.11 48.49,46.46 48.49,54.69 47.22,55.96 JP5.13
PB3
  Top 0.305: U1.9 51.03,43.05 47.22,46.86 JP5.14
PB4
  Top 0.305: U1.10 50.23,42.98 45.95,47.27 45.95,54.69 44.68,55.96 JP5.15
PB5
  Top 0.305: U1.11 49.44,42.92 44.68,47.68 JP5.16
PB6
  Top 0.305: U1.12 48.63,42.86 43.41,48.08 43.41,54.69 42.14,55.96 JP5.17
PB7
  Top 0.305: U1.13 47.84,42.79 42.14,48.49 JP5.18
PC0
  Top 0.305: U1.16 45.44,39.35 44.25,40.54 44.25,45.52 40.87,48.9 40.87,54.61 | 40.87,54.69 40.87,54.61 | JP5.19 39.6,55.88 40.87,54.61
PC1
  Top 0.305: U1.17 43.63,45.27 39.6,49.3 JP5.20
PDI_CLK
  Top 0.305: U1.57 61.58,30.88 64.25,28.21 R24.1 | R24.1 65.43,28.31 | R24.1 72.86,28.21 73.64,28.98 73.64,31.14 JP1.5
  Bottom 0.813: S2.2 JP1.5
PDI_DATA
  Top 0.305: U1.56 61.51,30.08 64.24,27.36 JP1.1
RXD
  Top 0.305: U1.28 41.8,27.68 40.74,26.62 40.74,25.25 40.26,24.77 JP2.3
RXI_N
  Top 0.241: IC6.6 23.27,38.64 21.44,36.81 21.44,32.32 17.78,28.66 17.78,26.42 17.78,25.26 arc90 18.16,24.88 20.62,24.88 arc-90 21,24.5 | 21,24.48 arc-90 20.62,24.1 18.16,24.1 arc90 17.78,23.71 | 17.78,23.69 arc90 18.16,23.31 20.62,23.31 arc-90 21,22.93 | 21,22.91 arc-90 20.62,22.53 18.16,22.53 arc90 17.78,22.15 RJ1.RD-
  Top 0.254: 21,24.5 21,24.48 | 17.78,23.71 17.78,23.69 | 21,22.93 21,22.91 | R6.2 18.07,26.12 17.78,26.42
RXI_P
  Top 0.241: IC6.5 22.87,38.89 20.98,37 20.98,32.51 17.32,28.85 17.32,27.69 17.32,21.13 16.51,20.32 16.51,19.05 17.14,18.41 18.41,18.41 19.05,19.05 19.05,20.32 19.68,20.95 20.95,20.95 21.59,20.32 RJ1.RD+
  Top 0.254: R5.2 17.32,27.69
S$1  (via drill 0.6 pad 1.78)
  other vias: 5,55.33
S$2  (via drill 0.6 pad 1.78)
  other vias: 75.64,55.33
S$3  (via drill 0.6 pad 1.78)
  other vias: 75.64,4.92
S$4  (via drill 0.6 pad 1.78)
  other vias: 5,4.92
SD_CS
  Top 0.305: U1.46 55.84,20.7 58.1,18.43 R21.1 | U2.2
  Top 0.406: U2.2 62.44,18.61 R21.1
SD_LED  (via drill 0.6 pad 1.42)
  Top 0.305: U1.47 56.63,21.39 57.56,20.47 v62.05,20.47
  Bottom 0.61: v62.05,20.47 67.79,20.47 69.01,19.25 R25.2
SD_MISO
  Top 0.305: U1.42 52.63,16.99 54.63,14.99 58.85,14.99 59.23,14.61 59.23,13.59 59.72,13.11 U2.7
SD_MOSI
  Top 0.305: U1.43 53.44,17.05 54.88,15.61 55.84,15.61 57.05,16.82 59.21,16.82 59.97,17.58 66.28,17.58 U2.3
SD_PRESENT
  Top 0.305: R22.1 64.6,12.03 64.14,12.5 59.46,12.5 58.78,13.18 54.71,13.18 51.21,16.69 51.21,20.55 50.23,21.52 U1.39
  Top 0.61: R22.1 U2.CD1
SD_SCK
  Top 0.305: R19.1 57.55,14.38 54.38,14.38 51.84,16.92 U1.41
TXD
  Top 0.305: U1.29 41.87,26.88 41.35,26.36 41.35,23.29 40.28,22.23 JP2.2
TXO_N
  Top 0.241: IC6.9 24.47,38.4 22.45,36.38 22.45,32.48 24.59,30.35 24.59,29.21 24.59,18.82 25.32,18.09 25.32,16.2 25.07,15.95 23.19,15.95 22.86,16.28 RJ1.TD-
  Top 0.254: R7.1 24.74,29.36 24.59,29.21
TXO_P
  Top 0.241: IC6.8 24.07,38.64 22,36.57 22,32.29 24.13,30.16 24.13,27.94 | RJ1.TD+ 24.13,20.89 arc90 23.75,21.27 23.27,21.27 arc-90 22.89,21.66 | 22.89,21.68 arc-90 23.27,22.06 23.75,22.06 arc90 24.13,22.44 | 24.13,22.46 arc90 23.75,22.84 23.27,22.84 arc-90 22.89,23.23 | 22.89,23.25 arc-90 23.27,23.63 23.75,23.63 arc90 24.13,24.01 | 24.13,24.04 arc90 23.75,24.42 23.27,24.42 arc-90 22.89,24.8 | 22.89,24.82 arc-90 23.27,25.2 23.75,25.2 arc90 24.13,25.58 | 24.13,25.61 arc90 23.75,25.99 23.27,25.99 arc-90 22.89,26.37 | 22.89,26.39 arc-90 23.27,26.77 23.75,26.77 arc90 24.13,27.15 24.13,27.94 | 24,27.81 24.13,27.94
  Top 0.254: 22.89,21.66 22.89,21.68 | 24.13,22.44 24.13,22.46 | 22.89,23.23 22.89,23.25 | 24.13,24.01 24.13,24.04 | 22.89,24.8 22.89,24.82 | 24.13,25.58 24.13,25.61 | 22.89,26.37 22.89,26.39 | R8.1 24,27.81
VBUS
  Top 0.254: IC1.5 43,8.57 43,7.8 42.8,7.59 C27.1
  Top 0.61: 35.53,11.1 C4.+ | C14.1 | C27.1 38.12,7.6 37.21,8.51 F1.2
  Top 0.813: F1.2 35.53,11.1 | C4.+ C14.1 | C14.1 35.55,16.52 IC2.3
VBUS_IN
  Top 0.406: JP3.VBUS1 42.21,4.15 40.64,5.71 F1.1
W5100_CS
  Top 0.241: IC6.29 35.02,45.81 37.05,43.78 R2.1
  Top 0.61: R2.1 R18.2
W5100_INT
  Top 0.241: IC6.56 22.87,51.4 23.52,50.75 29.06,50.75 29.67,51.36 34.52,51.36 40.9,44.98 R13.1
  Top 0.406: R13.1 40.9,41.02 41.53,40.38 41.53,36.35 42.2,35.68 U1.18
W5100_MISO
  Top 0.241: IC6.27 34.24,45.01 35.56,43.69 35.56,34.29 37.37,32.48 U1.22
W5100_MOSI
  Top 0.241: IC6.28 34.63,45.41 36.12,43.92 36.12,34.52 37.31,33.33
  Top 0.243: 37.31,33.33 R16.2
W5100_RST
  Top 0.241: IC6.59 21.67,51.43 22.91,50.19 29.29,50.19 29.92,50.83 34.27,50.83 40.05,45.05 R14.1
  Top 0.406: U1.19 41.95,34.88 40.68,36.16 40.68,39.97 40.05,40.6 R14.1
W5100_SCK
  Top 0.241: IC6.30 35.4,46.21 37.9,43.71 37.9,35.64 40.25,33.28 U1.21
XTLN
  Top 0.241: IC6.75 11.18,44.61 | 11.18,44.61 10.54,44.61 9.88,45.26 R11.1 | Y1.3 11.19,44.62 11.18,44.61
  Top 0.406: C16.2 R11.1
XTLP
  Top 0.241: IC6.76 13.46,44.21 | 13.46,44.21 10.54,44.21 9.9,43.56 R11.2 | Y1.1 13.49,44.17 13.46,44.21
  Top 0.406: C15.2 R11.2